# Altium schematic sheet ADC_CONN.SchDoc
size A
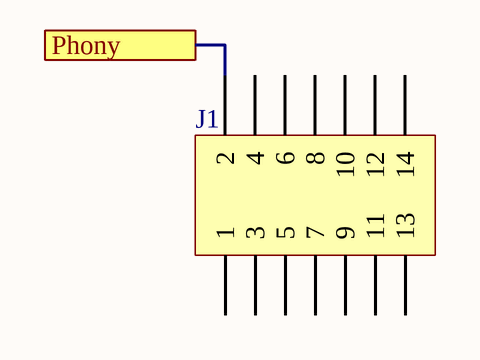
[diagram p0: ADC_CONN.SchDoc]

## Parts
J1  Header 7X2  [CLP-107-02-F-D-A-TR]  (value not drawn)

## Ports
Phony

## Nets
Phony: J1.2 ; port Phony

Not connected (* = marked no-connect by the designer): J1 1 3 4 5 6 7 8 9 10 11 12 13 14

## Library data of the parts
J1 = Header 7X2: Header, 7-Pin, Dual row; System: Connector; LatestRevisionDate: 17-Jul-2002; LatestRevisionNote: Re-released for DXP Platform.; Publisher: Altium Limited